# EAGLE design NRF24L01_DS18B20a (EAGLE 6.4)
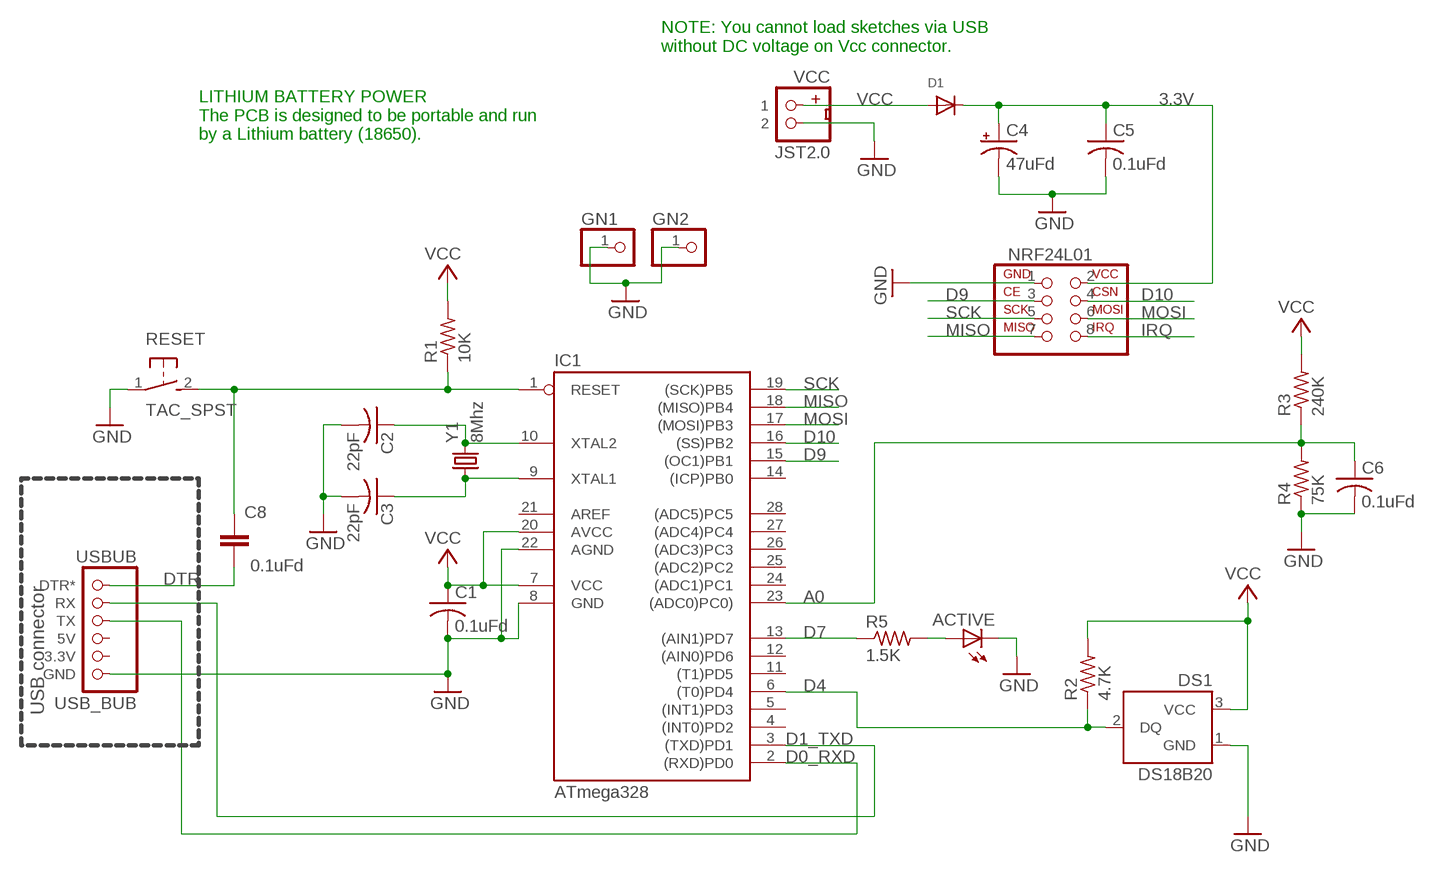
[diagram p0: schematic, sheet 1]

## Parts
ACTIVE  LED3MM  [LED3MM]
C1  0.1uFd  C-US025-025X050  [C025-025X050]
C2  22pF  C-US025-025X050  [C025-025X050]
C3  22pF  C-US025-025X050  [C025-025X050]
C4  47uFd  CPOL-USE2.5-6  [E2,5-6]
C5  0.1uFd  C-US025-025X050  [C025-025X050]
C6  0.1uFd  C-US025-025X050  [C025-025X050]
C8  0.1uFd  C-EU050-025X075  [C050-025X075]
D1  DIODEDO-1N4148  [DO-1N4148]
DS1  DS18B20  [DS18B20]
GN1  PINHD-1X1  [1X01]
GN2  PINHD-1X1  [1X01]
IC1  ATmega328  AT90S4433P  [DIL28-3]
NRF24L01  NRF24L01+  [NRF24L01+]
R1  10K  R-US_0207/2V  [0207/2V]
R2  4.7K  R-US_0207/2V  [0207/2V]
R3  240K  R-US_0207/10  [0207/10]
R4  75K  R-US_0207/2V  [0207/2V]
R5  1.5K  R-US_0207/2V  [0207/2V]
RESET  TAC_SPST  [TACTILE-SPST]
USBUB  USB_BUB  [USB_BUB]
VCC  JST2.0  [JST2.0]
Y1  8Mhz  CRYSTALTC38H  [TC38H]

## Nets
3.3V: C4.+ C5.1 D1.C NRF24L01.2
A0: C6.1 IC1.23((ADC0)PC0)) R3.1 R4.2
D0_RXD: IC1.2((RXD)PD0) USBUB.TX
D1_TXD: IC1.3((TXD)PD1) USBUB.RX
D4: DS1.2(DQ) IC1.6((T0)PD4) R2.1
D7: IC1.13((AIN1)PD7) R5.1
D9: IC1.15((OC1)PB1) NRF24L01.3
D10: IC1.16((SS)PB2) NRF24L01.4
DTR: C8.1 USBUB.DTR*
GND [power]: ACTIVE.K(C) C1.2 C2.2 C3.2 C4.- C5.2 C6.2 DS1.1(GND) GN1.1 GN2.1 IC1.8(GND) IC1.22(AGND) NRF24L01.1 R4.1 RESET.1 USBUB.GND VCC.2
IRQ: NRF24L01.8
MISO: IC1.18((MISO)PB4) NRF24L01.7
MOSI: IC1.17((MOSI)PB3) NRF24L01.6
N$2: ACTIVE.A R5.2
N$6: C3.1 IC1.9(XTAL1) Y1.1
N$7: C2.1 IC1.10(XTAL2) Y1.2
RESET: C8.2 IC1.1(RESET) R1.1 RESET.2
SCK: IC1.19((SCK)PB5) NRF24L01.5
VCC: C1.1 D1.A DS1.3(VCC) IC1.7(VCC) IC1.20(AVCC) R1.2 R2.2 R3.2 VCC.1
Unconnected: IC1.4((INT0)PD2) IC1.5((INT1)PD3) IC1.11((T1)PD5) IC1.12((AIN0)PD6) IC1.14((ICP)PB0) IC1.21(AREF) IC1.24((ADC1)PC1) IC1.25((ADC2)PC2) IC1.26((ADC3)PC3) IC1.27((ADC4)PC4) IC1.28((ADC5)PC5) USBUB.3.3V USBUB.5V

## Notes on the sheet
- NOTE: You cannot load sketches via USB 
  without DC voltage on Vcc connector.
- LITHIUM BATTERY POWER
  The PCB is designed to be portable and run
  by a Lithium battery (18650).
- USB connector

## Library data of the parts
ACTIVE = adafruit:LED: LED OSRAM: - CHIPLED LG R971, LG N971, LY N971, LG Q971, LY Q971, LO R971, LY R971 LH N974, LH R974 LS Q976, LO Q976, LY Q976 LO Q996 - Hyper CHIPLED LW Q18S LB Q993, LB Q99A, LB R99A - SideLED LS A670, LO A670, LY A670, LG A670, LP A670 LB A673, LV A673, LT A673, LW A673 LH A674 LY A675 LS A676, LA A676, LO A676, LY A676, LW A676 LS A679, LY A679, LG A679 - Hyper Micro SIDELED® LS Y876, LA Y876, LO Y876, LY Y876 LT Y87S - SmartLED LW L88C, LW L88S LB L89C, LB L89S, LG L890 LS L89K, LO L89K, LY L89K LS L896, LA L896, LO L896, LY L896 - TOPLED LS T670, LO T670, LY T670, LG T670, LP T670 LSG T670, LSP T670, LSY T670, LOP T670, LYG T670 LG T671, LOG T671, LSG T671 LB T673, LV T673, LT T673, LW T673 LH T674 LS T676, LA T676, LO T676, LY T676, LB T676, LH T676, LSB T676, LW T676 LB T67C, LV T67C, LT T67C, LS T67K, LO T67K, LY T67K, LW E67C LS E67B, LA E67B, LO E67B, LY E67B, LB E67C, LV E67C, LT E67C LW T67C LS T679, LY T679, LG T679 LS T770, LO T770, LY T770, LG T770, LP T770 LB T773, LV T773, LT T773, LW T773 LH T774 LS E675, LA E675, LY E675, LS T675 LS T776, LA T776, LO T776, LY T776, LB T776 LHGB T686 LT T68C, LB T68C - Hyper Mini TOPLED® LB M676 - Mini TOPLED Santana® LG M470 LS M47K, LO M47K, LY M47K Source: http://www.osram.convergy.de/
C1-C3 C5 C6 = MTS:C-US: CAPACITOR, American symbol
C4 = rcl:CPOL-US: POLARIZED CAPACITOR, American symbol
C8 = my-rcl:C-EU: CAPACITOR, European symbol
D1 = adafruit:DIODE: Diode SMADIODE - SMA Surface Mount Package 20V 1A Schottky Diode Digikey: 641-1014-6-ND DO-1N4148 - Through Hole Small Current Diode SOD-123 20V 1 A (.5mV Vf) Schottky Diode - Digikey: MBRX120TPMSCT-ND SOD-323 10V 570mA (.38mV Vf, 3ns) Schottky Diode - Digikey: ZLLS410CT-ND SOD-523 30V 30mA Schottky Diode (RB751S-40TE61) - Digikey: RB751S-40TE61CT-ND SOT23-R/W - SOT23 Package (R = Solder Paste/Reflow Ovens, W = Hand-Soldering) BAT54Film 40V 300mA - Digikey: 497-7162-1-ND
DS1 = MTS_Custom:DS18B20
GN1 GN2 = pinhead:PINHD-1X1: PIN HEADER
IC1 = atmel:AT90S4433: MICROCONTROLLER 4 Kbytes FLASH 128 bytes SRAM 256 bytes EEPROM UART 6-channel 10 bit ADC
NRF24L01 = MTS_Custom:NRF24L01+
R1-R5 = MTS:R-US_: RESISTOR, American symbol
RESET = MTS_Custom:TAC_SPST: Tactile switch SPST 7mm lead spacing
USBUB = MTS:USB_BUB
VCC = MTS_Custom:JST2.0
Y1 = MTS:CRYSTAL: Crystals Various standard crystals. Proven footprints. Spark Fun Electronics SKU : COM-00534

## Net classes
0 default: width 0.4 mm, clearance 0.3 mm
1 power: width 0.6 mm, clearance 0.3 mm

## Board
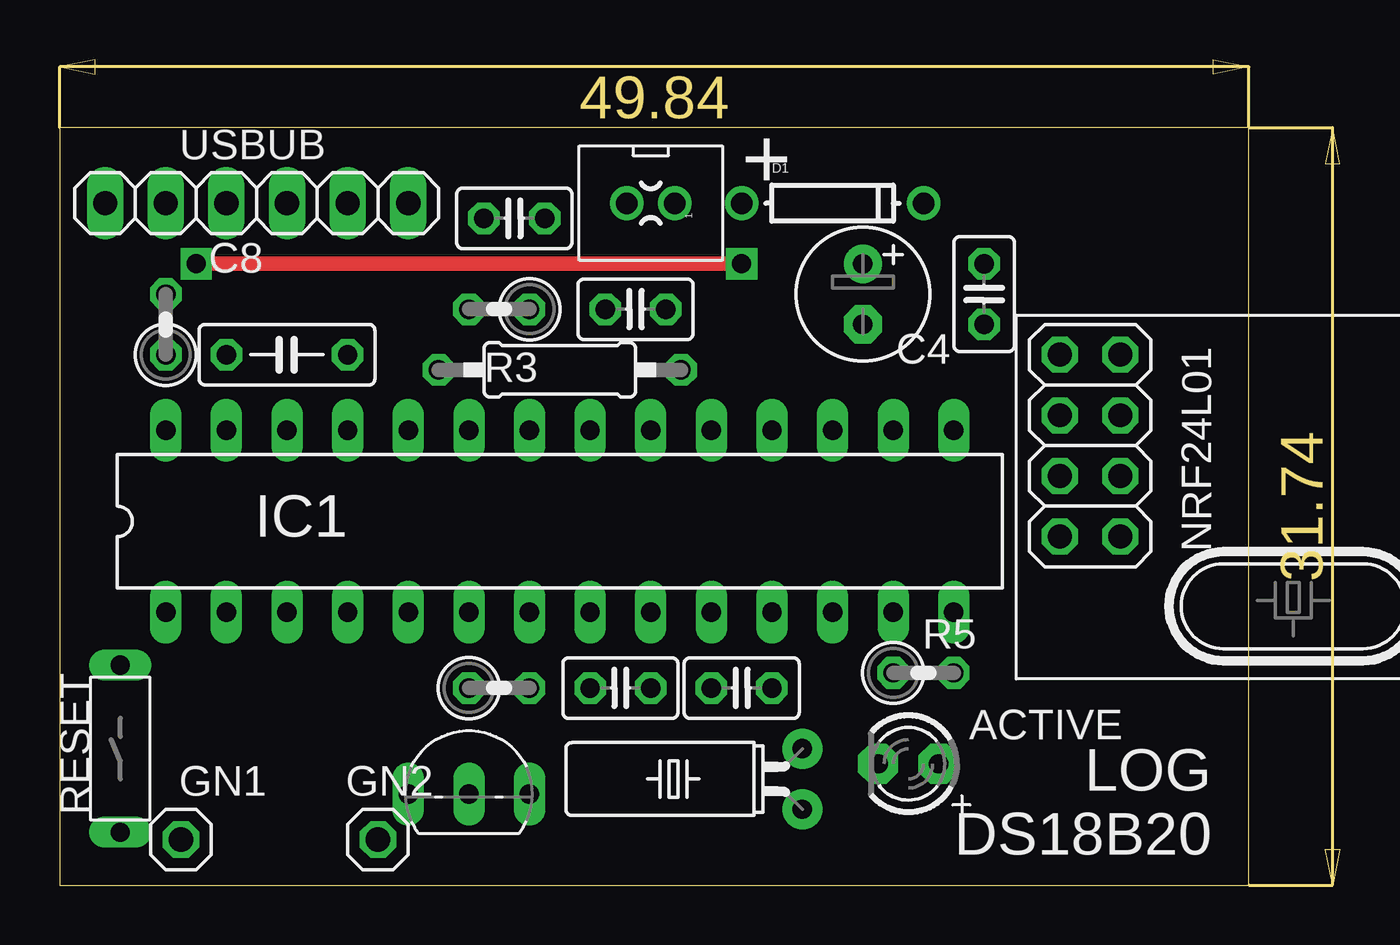
[diagram p1: board, top side]
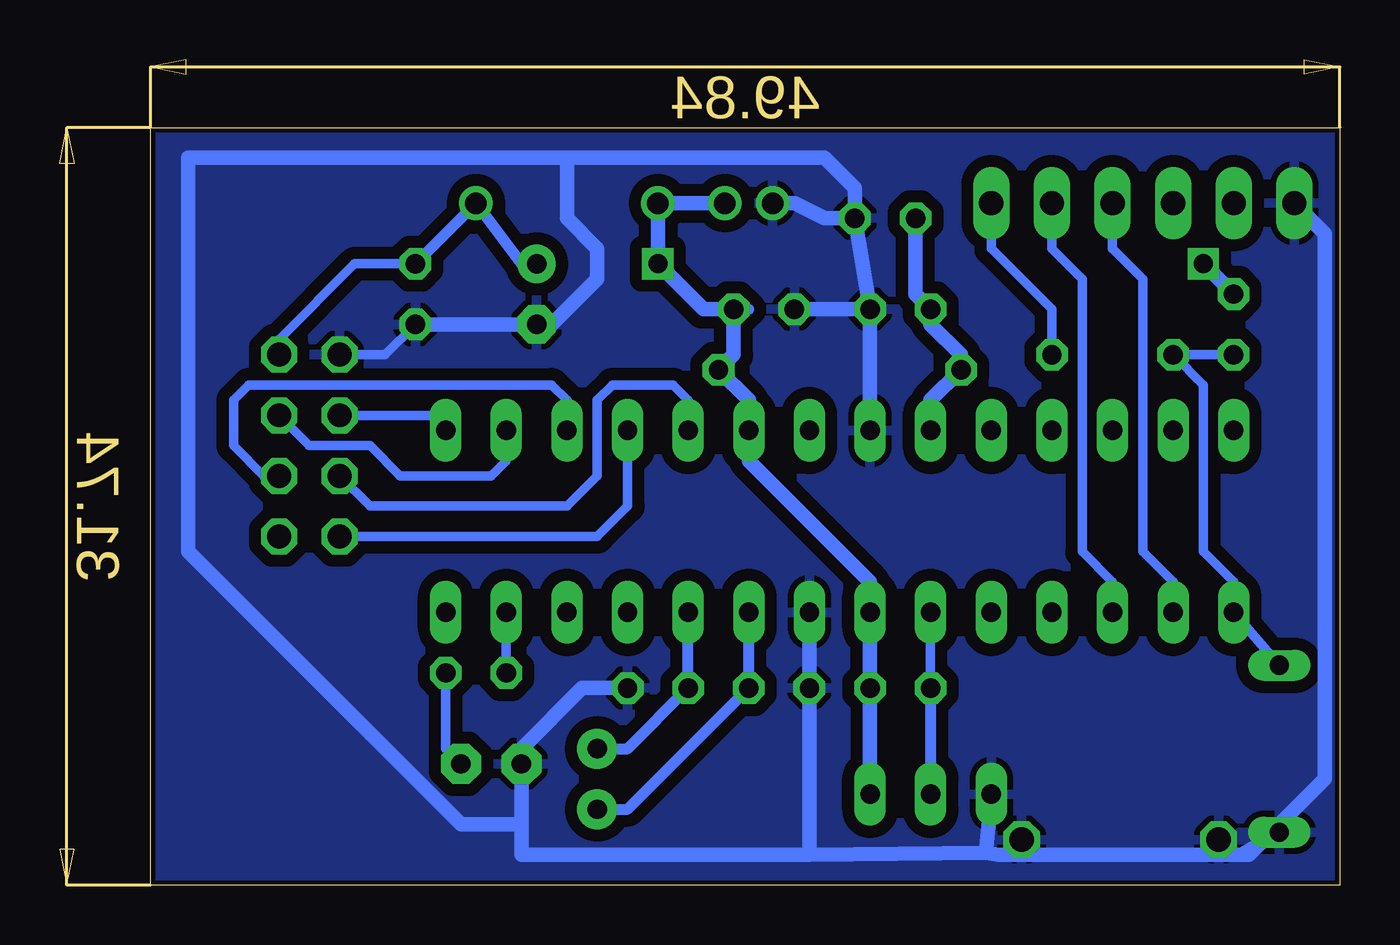
[diagram p2: board, bottom side, seen from below]

Size 49.84 x 31.74 mm. Coordinates in mm from the lower left corner, seen from the top.
Outline: 0,0 49.84,0 49.84,31.74 0,31.74 0,0
Copper layers (1*16): Top 0.035mm / dielectric 1.5mm / Bottom 0.035mm
Design rules "MTS1 *": minimum track width 18mil, minimum drill 12mil, track to track 20mil, track to pad 20mil, pad to pad 6mil, via to via 6mil, smd to smd 0mil, copper to edge 8mil, drill to drill 10mil, minimum pad ring 10mil, minimum via ring 10mil, stop-mask expansion 2mil, vias tented up to drill 25mil, thermal gap 10mil

### Footprints (pad centres in the part's own frame; a part is rotated, then mirrored left to right if it is on the bottom)
LED3MM = drill 0.813 pad 1.676 octagon: A -1.27,0; K 1.27,0
C025-025X050 = drill 0.813 octagon: 1 -1.27,0; 2 1.27,0
E2,5-6 = drill 0.813 pad 1.6: + -1.27,0 | drill 0.813 pad 1.6 octagon: - 1.27,0
C050-025X075 = drill 0.813 octagon: 1 -2.54,0; 2 2.54,0
DO-1N4148 = drill 0.9: A -3.81,0; C 3.81,0
DS18B20 = drill 0.813 long: 1 -2.54,-1.27; 2 0,-1.27; 3 2.54,-1.27
1X01 = drill 1.016 octagon: 1 0,0
DIL28-3 = drill 0.813 long: 1 -16.51,-3.81; 2 -13.97,-3.81; 3 -11.43,-3.81; 4 -8.89,-3.81; 5 -6.35,-3.81; 6 -3.81,-3.81; 7 -1.27,-3.81; 8 1.27,-3.81; 9 3.81,-3.81; 10 6.35,-3.81; 11 8.89,-3.81; 12 11.43,-3.81; 13 13.97,-3.81; 14 16.51,-3.81; 15 16.51,3.81; 16 13.97,3.81; 17 11.43,3.81; 18 8.89,3.81; 19 6.35,3.81; 20 3.81,3.81; 21 1.27,3.81; 22 -1.27,3.81; 23 -3.81,3.81; 24 -6.35,3.81; 25 -8.89,3.81; 26 -11.43,3.81; 27 -13.97,3.81; 28 -16.51,3.81
NRF24L01+ = drill 1 octagon: 1 -5.08,-12.7; 2 -5.08,-10.16; 3 -2.54,-12.7; 4 -2.54,-10.16; 5 0,-12.7; 6 0,-10.16; 7 2.54,-12.7; 8 2.54,-10.16
0207/2V = drill 0.813 octagon: 1 -1.27,0; 2 1.27,0
0207/10 = drill 0.813 octagon: 1 -5.08,0; 2 5.08,0
TACTILE-SPST = drill 0.8 long: 1 0,3.5; 2 0,-3.5
USB_BUB = drill 1.016 long: 3.3V -3.81,0; 5V -1.27,0; DTR* 6.35,0; GND -6.35,0; RX 3.81,0; TX 1.27,0
JST2.0 = drill 0.9 pad 1.016: 1 0,-1; 2 0,1
TC38H = drill 0.813 pad 1.676: 1 -1.27,0; 2 1.27,0

### Placement (x,y rotation side)
ACTIVE  35.56,5.08 180 top
C1  24.13,24.13 180 top
C2  28.57,8.26 0 top
C3  23.5,8.26 180 top
C4  33.66,24.77 270 top
C5  38.73,24.77 270 top
C6  19.05,27.94 0 top
C8  9.53,22.23 180 top
D1  32.38,28.57 0 top
DS1  17.14,5.08 0 top
GN1  5.08,1.91 0 top
GN2  13.34,1.91 0 top
IC1  20.95,15.24 0 top
NRF24L01  54.61,17.14 270 top
R1  4.45,23.5 90 top
R2  18.41,8.26 0 top
R3  20.95,21.59 0 top
R4  18.41,24.13 180 top
R5  36.2,8.89 0 top
RESET  2.54,5.71 180 top
USBUB  8.26,28.57 0 top
VCC  24.77,28.57 90 top
Y1  31.11,4.45 90 top

### Tracks (layer width: path | path; a pad name or v marks a point on that pad's centre or on a via)
3.3V
  Bottom 0.406: NRF24L01.2 44.45,22.86 41.27,26.04 C5.1
  Bottom 0.457: C4.+ 34.29,26.04 D1.C C5.1
A0
  Bottom 0.61: IC1.23 17.14,20.32 R3.1 15.88,22.23 17.14,23.5 R4.2 17.78,24.77 C6.1
D0_RXD
  Bottom 0.406: IC1.2 6.99,12.7 8.26,13.97 8.26,25.4 9.53,26.67 USBUB.TX
D1_TXD
  Bottom 0.406: USBUB.RX 12.06,26.67 10.79,25.4 10.79,13.97 9.53,12.7 IC1.3
D4
  Bottom 0.406: R2.1 IC1.6
  Bottom 0.457: R2.1 DS1.2
D7
  Bottom 0.406: IC1.13 R5.1
D9
  Bottom 0.406: IC1.15 38.1,19.68 NRF24L01.3
D10
  Bottom 0.406: IC1.16 34.92,17.78 35.56,17.14 39.37,17.14 40.64,18.41 43.18,18.41 NRF24L01.4
DTR
  Bottom 0.406: C8.1 12.06,24.13 14.61,26.67 USBUB.DTR*
GND
  Bottom 0.406: C5.2 40.01,22.23 NRF24L01.1
  Bottom 0.6: R4.1 IC1.22 | IC1.8 C3.2 22.23,1.27 | 22.23,1.27 14.82,1.36 DS1.1 | 22.23,1.27 34.29,1.27 34.29,2.54 | R4.1 C1.2 | USBUB.GND 0.64,27.3 0.64,11.43 | C5.2 C4.- 33.02,23.5 31.11,25.4 31.11,26.67 32.38,27.94 32.38,30.48 | C6.2 R4.1 | C6.2 21.59,27.94 22.86,28.57 VCC.2 | C6.2 20.32,29.21 21.59,30.48 32.38,30.48 | 32.38,30.48 48.26,30.48 48.26,13.97 36.83,2.54 34.29,2.54 | 34.29,2.54 ACTIVE.K
  Bottom 0.61: 4.13,1.27 3.81,1.27 0.64,4.45 0.64,11.43 | 4.13,1.27 RESET.1 | 4.13,1.27 5.08,1.27 | 5.08,1.27 13.34,1.27 | 13.34,1.27 14.28,1.27 14.82,1.36 | GN2.1 13.34,1.27 | GN1.1 5.08,1.27 | C2.2 31.75,8.26 34.29,5.71 ACTIVE.K
  pour Bottom: 0,0 50.16,0 50.16,32.38 0,32.38
MISO
  Bottom 0.406: NRF24L01.7 31.11,14.61 29.84,15.88 IC1.18
MOSI
  Bottom 0.406: NRF24L01.6 45.09,17.14 46.35,18.41 46.35,20.32 45.72,20.95 33.02,20.95 32.38,20.32 IC1.17
N$2
  Bottom 0.406: R5.2 37.47,5.71 ACTIVE.A
N$6
  Bottom 0.457: Y1.1 29.84,3.17 C3.1 IC1.9
N$7
  Bottom 0.457: Y1.2 29.84,5.71 C2.1 IC1.10
RESET
  Bottom 0.406: RESET.2 IC1.1 4.45,12.7 5.71,13.97 5.71,20.95 C8.2 R1.1
SCK
  Bottom 0.406: IC1.19 27.3,20.32 27.94,20.95 30.48,20.95 31.11,20.32 31.11,17.14 32.38,15.88 40.64,15.88 NRF24L01.5
VCC  (via drill 0.8)
  Top 0.61: v5.71,26.04 v28.57,26.04
  Bottom 0.457: 24.77,24.13 C1.1 26.04,24.13
  Bottom 0.61: DS1.3 R2.2 IC1.7 19.68,12.7 24.77,17.78 IC1.20 24.77,20.32 R3.2 25.4,22.23 C1.1 26.67,24.13 v28.57,26.04 D1.A VCC.1 | v5.71,26.04 R1.2

### Text on the board
tPlace: LOG / DS18B20
tNames: +